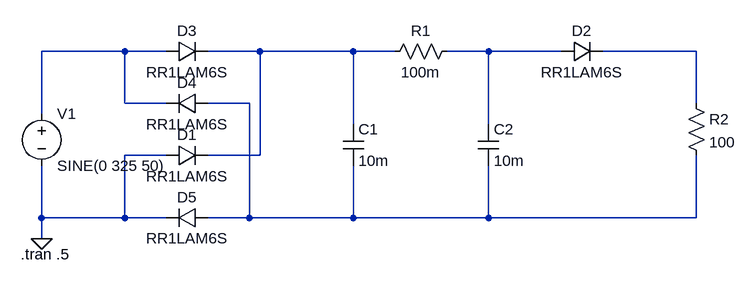
[diagram p0: schematic recitifier.asc]
recitifier.asc, the LTspice schematic file:
Version 4
SHEET 1 1044 680
WIRE 48 -144 -80 -144
WIRE 112 -144 48 -144
WIRE 256 -144 176 -144
WIRE 400 -144 256 -144
WIRE 464 -144 400 -144
WIRE 608 -144 544 -144
WIRE 720 -144 608 -144
WIRE 928 -144 784 -144
WIRE 48 -64 48 -144
WIRE 112 -64 48 -64
WIRE 240 -64 176 -64
WIRE 928 -64 928 -144
WIRE -80 -48 -80 -144
WIRE 400 -32 400 -144
WIRE 608 -32 608 -144
WIRE 112 16 48 16
WIRE 256 16 256 -144
WIRE 256 16 176 16
WIRE -80 112 -80 32
WIRE 48 112 48 16
WIRE 48 112 -80 112
WIRE 112 112 48 112
WIRE 240 112 240 -64
WIRE 240 112 176 112
WIRE 400 112 400 32
WIRE 400 112 240 112
WIRE 608 112 608 32
WIRE 608 112 400 112
WIRE 928 112 928 16
WIRE 928 112 608 112
WIRE -80 144 -80 112
FLAG -80 144 0
SYMBOL voltage -80 -64 R0
WINDOW 123 0 0 Left 0
WINDOW 39 0 0 Left 0
SYMATTR InstName V1
SYMATTR Value SINE(0 325 50)
SYMBOL res 912 -80 R0
SYMATTR InstName R2
SYMATTR Value 100
SYMBOL diode 112 -128 R270
WINDOW 0 32 32 VTop 2
WINDOW 3 0 32 VBottom 2
SYMATTR InstName D3
SYMATTR Value RR1LAM6S
SYMBOL diode 112 32 R270
WINDOW 0 32 32 VTop 2
WINDOW 3 0 32 VBottom 2
SYMATTR InstName D1
SYMATTR Value RR1LAM6S
SYMBOL diode 176 -80 R90
WINDOW 0 0 32 VBottom 2
WINDOW 3 32 32 VTop 2
SYMATTR InstName D4
SYMATTR Value RR1LAM6S
SYMBOL diode 176 96 R90
WINDOW 0 0 32 VBottom 2
WINDOW 3 32 32 VTop 2
SYMATTR InstName D5
SYMATTR Value RR1LAM6S
SYMBOL cap 384 -32 R0
SYMATTR InstName C1
SYMATTR Value 10m
SYMBOL res 560 -160 R90
WINDOW 0 0 56 VBottom 2
WINDOW 3 32 56 VTop 2
SYMATTR InstName R1
SYMATTR Value 100m
SYMATTR SpiceLine pwr=1W
SYMBOL cap 592 -32 R0
SYMATTR InstName C2
SYMATTR Value 10m
SYMBOL diode 720 -128 R270
WINDOW 0 32 32 VTop 2
WINDOW 3 0 32 VBottom 2
SYMATTR InstName D2
SYMATTR Value RR1LAM6S
TEXT -112 168 Left 2 !.tran .5

The netlist it stands for:
* recitifier.asc
V1 N001 0 SINE(0 325 50)
R2 N004 N005 100
D3 N001 N002 RR1LAM6S
D1 0 N002 RR1LAM6S
D4 N005 N001 RR1LAM6S
D5 N005 0 RR1LAM6S
C1 N002 N005 10m
R1 N003 N002 100m pwr=1W
C2 N003 N005 10m
D2 N003 N004 RR1LAM6S
.model D D
.lib standard.dio
.tran .5
.backanno
.end